# Altium project Cubesat Battery Board.PrjPcb
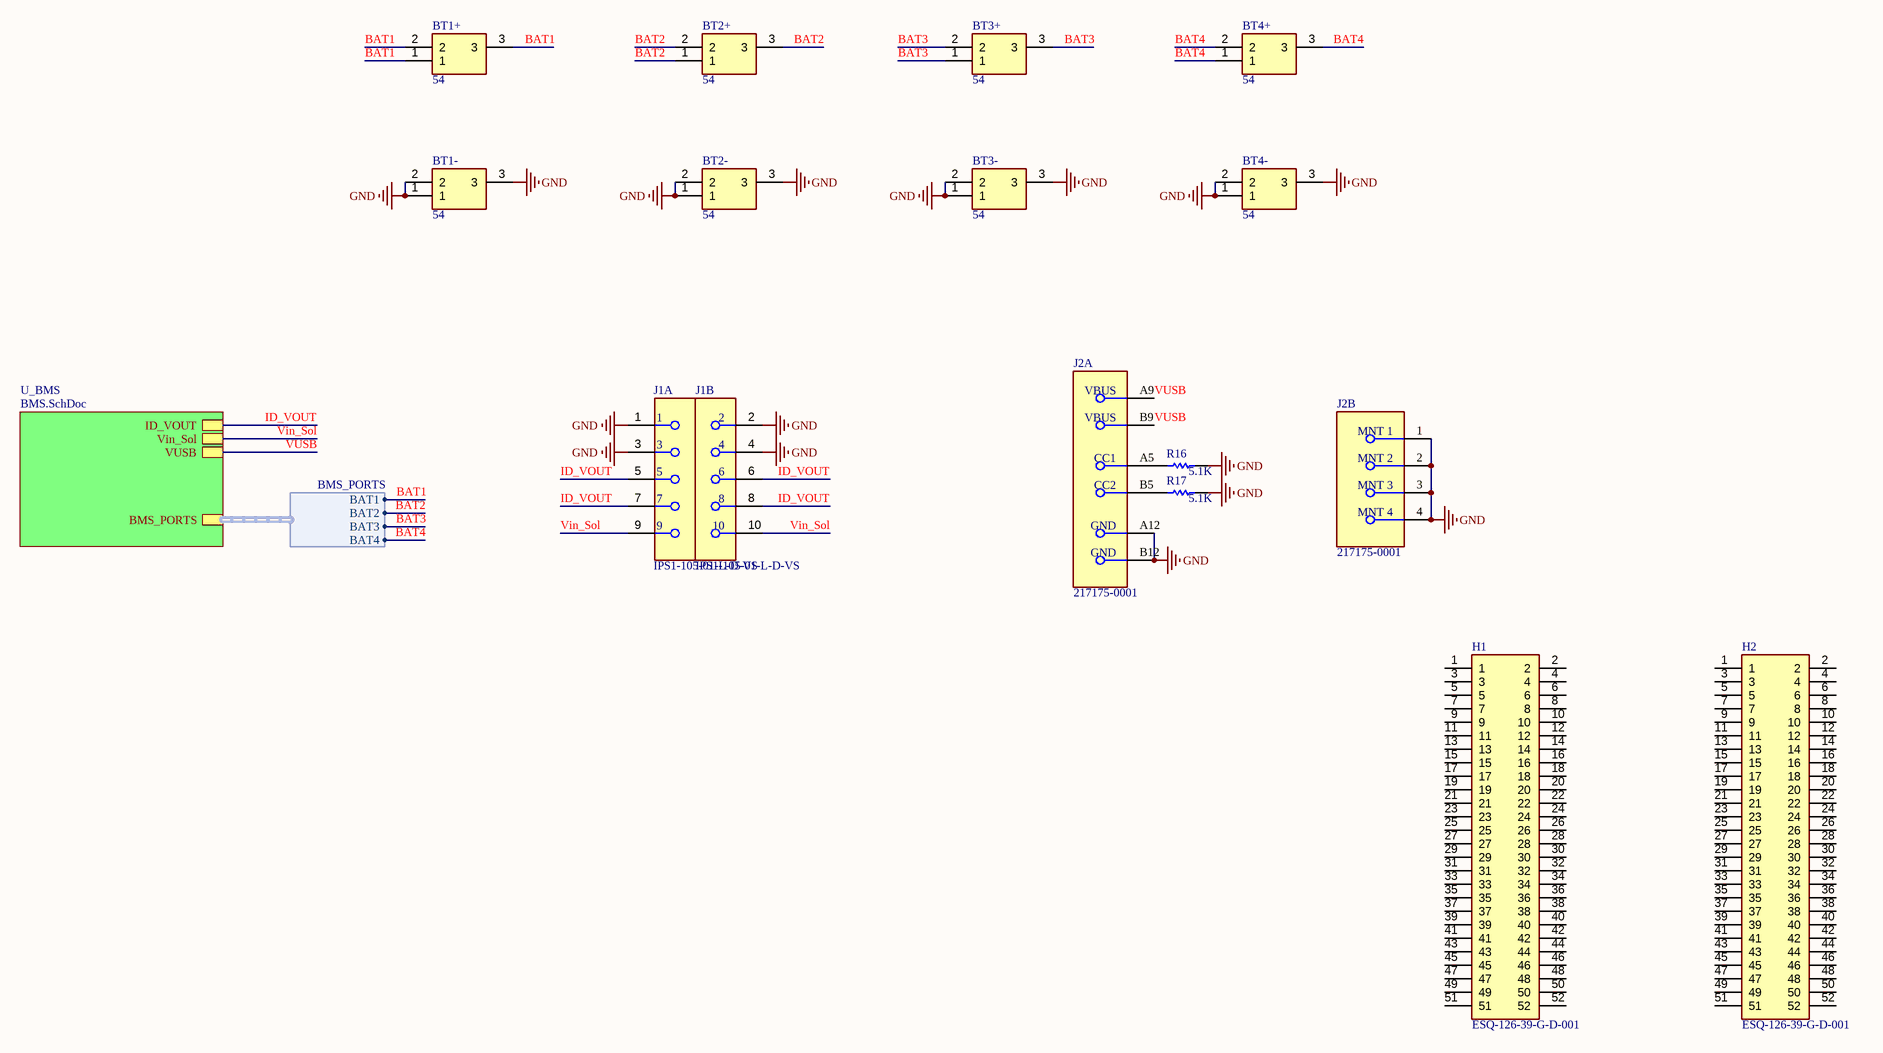
[diagram p0: Top.SchDoc]
CAGE_CODE: ?????; CONTRACT_NUMBER: <CONTRACT NO>; DOC_NO_ASSY_DWG: <ASSY DWG NO>; DOC_NO_BOM: <BOM DOC NO>; DOC_NO_FAB_DWG: <FAB DWG NO>; DOC_NO_SCH_DWG: <SCH DWG NO>; PCB_2_DEC_TOL: +/-.01; PCB_3_DEC_TOL: +/-.010; PCB_ANG_TOL: +/-1/2; PCB_ASSEMBLY_NO: <PCB ASSY NO>; PCB_CHECKER: - -----; PCB_CHECKER_APP_DATE: --/--/----; PCB_DESIGNER: - -----; PCB_DESIGNER_APP_DATE: --/--/----; PCB_DWG_NO: <PCB DWG NO>; PCB_ENGINEER: - -----; PCB_ENGINEER_APP_DATE: --/--/----; PCB_PART_NUMBER: <PCB PN>; PCB_REV: A; SCH_REV: A
3 sheets, 86 parts. Net scope: hierarchical (ports join the sheet entries above them; power ports are global).
Board files: battery board.PcbDoc, batteryreversed.PcbDoc
Sheets:
  Top.SchDoc
    U_BMS = BMS.SchDoc
      B1 = BatteryCharger.SchDoc
      B2 = BatteryCharger.SchDoc
      B3 = BatteryCharger.SchDoc
      B4 = BatteryCharger.SchDoc

## Sheet Top.SchDoc
size 420 x 297 mm; SheetNumber: 1; SheetTotal: 3

### Parts
BT1+  54  [54]
BT1-  54  [54]
BT2+  54  [54]
BT2-  54  [54]
BT3+  54  [54]
BT3-  54  [54]
BT4+  54  [54]
BT4-  54  [54]
H1  ESQ-126-39-G-D-001  [RHDR52W64P254_2X26_6654X495X1135P]
H2  ESQ-126-39-G-D-001  [RHDR52W64P254_2X26_6654X495X1135P]
J1  IPS1-105-01-L-D-VS  [FP-IPS1-105-01-L-D-VS-MFG]  (parts A,B of 2)
J2  217175-0001  [FP-217175-0001-MFG]  (parts A,B of 2)
R16  5.1K  [RESC1608X55X30LL15T15]
R17  5.1K  [RESC1608X55X30LL15T15]

### Sub-sheets
U_BMS = BMS.SchDoc: ID_VOUT, Vin_Sol, BMS_PORTS (harness BMS_PORTS), VUSB

### Harnesses
BMS_PORTS: BAT1, BAT2, BAT3, BAT4

### Nets
GND: BT1-.1 BT1-.2 BT1-.3 BT2-.1 BT2-.2 BT2-.3 BT3-.1 BT3-.2 BT3-.3 BT4-.1 BT4-.2 BT4-.3 J1.1 J1.2 J1.3 J1.4 J2.1(MNT_1) J2.2(MNT_2) J2.3(MNT_3) J2.4(MNT_4) J2.A12(GND) J2.B12(GND) R16.2 R17.2
BAT1: BT1+.1 BT1+.2 BT1+.3 ; sheet U_BMS/BMS_PORTS.BAT1
BAT2: BT2+.1 BT2+.2 BT2+.3 ; sheet U_BMS/BMS_PORTS.BAT2
BAT3: BT3+.1 BT3+.2 BT3+.3 ; sheet U_BMS/BMS_PORTS.BAT3
BAT4: BT4+.1 BT4+.2 BT4+.3 ; sheet U_BMS/BMS_PORTS.BAT4
ID_VOUT: J1.5 J1.6 J1.7 J1.8 ; sheet U_BMS/ID_VOUT
Vin_Sol: J1.9 J1.10 ; sheet U_BMS/Vin_Sol
VUSB: J2.A9(VBUS) J2.B9(VBUS) ; sheet U_BMS/VUSB
NetJ2_A5: J2.A5(CC1) R16.1
NetJ2_B5: J2.B5(CC2) R17.1

Not connected (* = marked no-connect by the designer): H1 1 2 3 4 5 6 7 8 9 10 11 12 13 14 15 16 17 18 19 20 21 22 23 24 25 26 27 28 29 30 31 32 33 34 35 36 37 38 39 40 41 42 43 44 45 46 47 48 49 50 51 52; H2 1 2 3 4 5 6 7 8 9 10 11 12 13 14 15 16 17 18 19 20 21 22 23 24 25 26 27 28 29 30 31 32 33 34 35 36 37 38 39 40 41 42 43 44 45 46 47 48 49 50 51 52

### Notes on the sheet
- THIS DOCUMENT AND THE DATA DISCLOSED HEREIN OR
- HEREWITH IS THE PROPERTY OF ALTIUM LIMITED AND MAY
- DWG NO:
- REVISION
- REV:
- DESCRIPTION
- DATE
- APPROVED
- BE FREELY DISTRIBUTED IN WHOLE. NO RIGHTS ARE
- RESERVED OR EXPRESS OR IMPLIED WARANTEE GIVEN.
- ENG:
- APPROVALS
- PROJECT
- DSN:
- CHK:
- REFERENCE DOCUMENTS
- PROJECT REVISION:
- TITLE
- DOCUMENT REVISION:
- DESIGN ITEM:
- BOM:
- FAB DWG:
- PCB DWG:
- ASSY DWG:
- SCALE:
- A3
- SIZE
- CAGE CODE
- FILE NAME
- DWG NO.
- SHEET
- OF
- REV

### Library data of the parts
BT1+ BT1- BT2+ BT2- BT3+ BT3- BT4+ BT4- = CMP-00029-00001-1: Battery; Manufacturer_Name: Keystone Electronics; Mouser Part Number: 534-54; Height: 16.97mm; Manufacturer_Part_Number: 54; Source: SamacSys.SchLib; Arrow Price/Stock: https://www.arrow.com/en/products/54/keystone-electronics?utm_currency=USD&region=europe; Datasheet Link: http://www.keyelco.com/product-pdf.cfm?p=826; Design Item ID: 54; Mouser Price/Stock: https://www.mouser.co.uk/ProductDetail/Keystone-Electronics/54?qs=73q%2FgRcW4F3NakoJDesViw%3D%3D; Arrow Part Number: 54
H1 H2 = CMP-002-00086-1: PC / 104 Connectors Elevated Socket Strip; Manufacturer_Name: SAMTEC; Design Item ID: ESQ-126-39-G-D-001; Mouser Price/Stock: https://www.mouser.co.uk/ProductDetail/Samtec/ESQ-126-39-G-D-001?qs=PB6%2FjmICvI2K%2FCIgL4SVbg%3D%3D; Mouser Part Number: 200-ESQ12639GD001; Source: SamacSys.SchLib; Arrow Price/Stock: https://www.arrow.com/en/products/esq-126-39-g-d-001/samtec?region=nac; Arrow Part Number: ESQ-126-39-G-D-001; Manufacturer_Part_Number: ESQ-126-39-G-D-001; Datasheet Link: http://suddendocs.samtec.com/catalog_english/esq_th.pdf; Height: 11.35mm
J1 = CMP-02766-000002-1: CONN RCPT 10POS 0.1 GOLD SMD; Manufacturer: Samtec; Standoff Height: 1.02mm; Is Female: yes; Voltage Rating: 1095V; Conn Orientation: Vertical; Conn Gender: Female; Pitch: 2.54mm; Number Of Contacts: 10; Package: 0; Category: Conn; Automotive: No; Height: 8.64mm; Temperature Range High: +125°C; Device Class L3: unset; Number Of Rows: 2; Device Class L2: Headers and Wire Housings; Device Class L1: Connectors; RoHS: TRUE; Temperature Range Low: -55°C; Octopart: https://octopart.com/ips1-105-01-l-d-vs-samtec-19544880; Temperature: -55°C to +125°C; Contact Material: Gold,Nickel; Digikey Description: CONN RCPT 10POS 0.1 GOLD SMD; Manufacturer Part Number: IPS1-105-01-L-D-VS; ComponentLink2URL: http://suddendocs.samtec.com/prints/ips1-1xx-xx-xx-d-vs-xx-xx-mkt.pdf; Footprint Url: http://suddendocs.samtec.com/prints/ips1-vs.pdf; ComponentLink2Description: Datasheet; Lead Free: Yes
J2 = CMP-04767-000026-1: CONN RCP USB2.0 C 6+18P SMD RA
R16 R17 = CMP-2000-00803-1: Part Number: ERJ-3GEYJ512V; Manufacturer: Panasonic

## Sheet BMS.SchDoc
size 420 x 297 mm; SheetNumber: 2; SheetTotal: 3
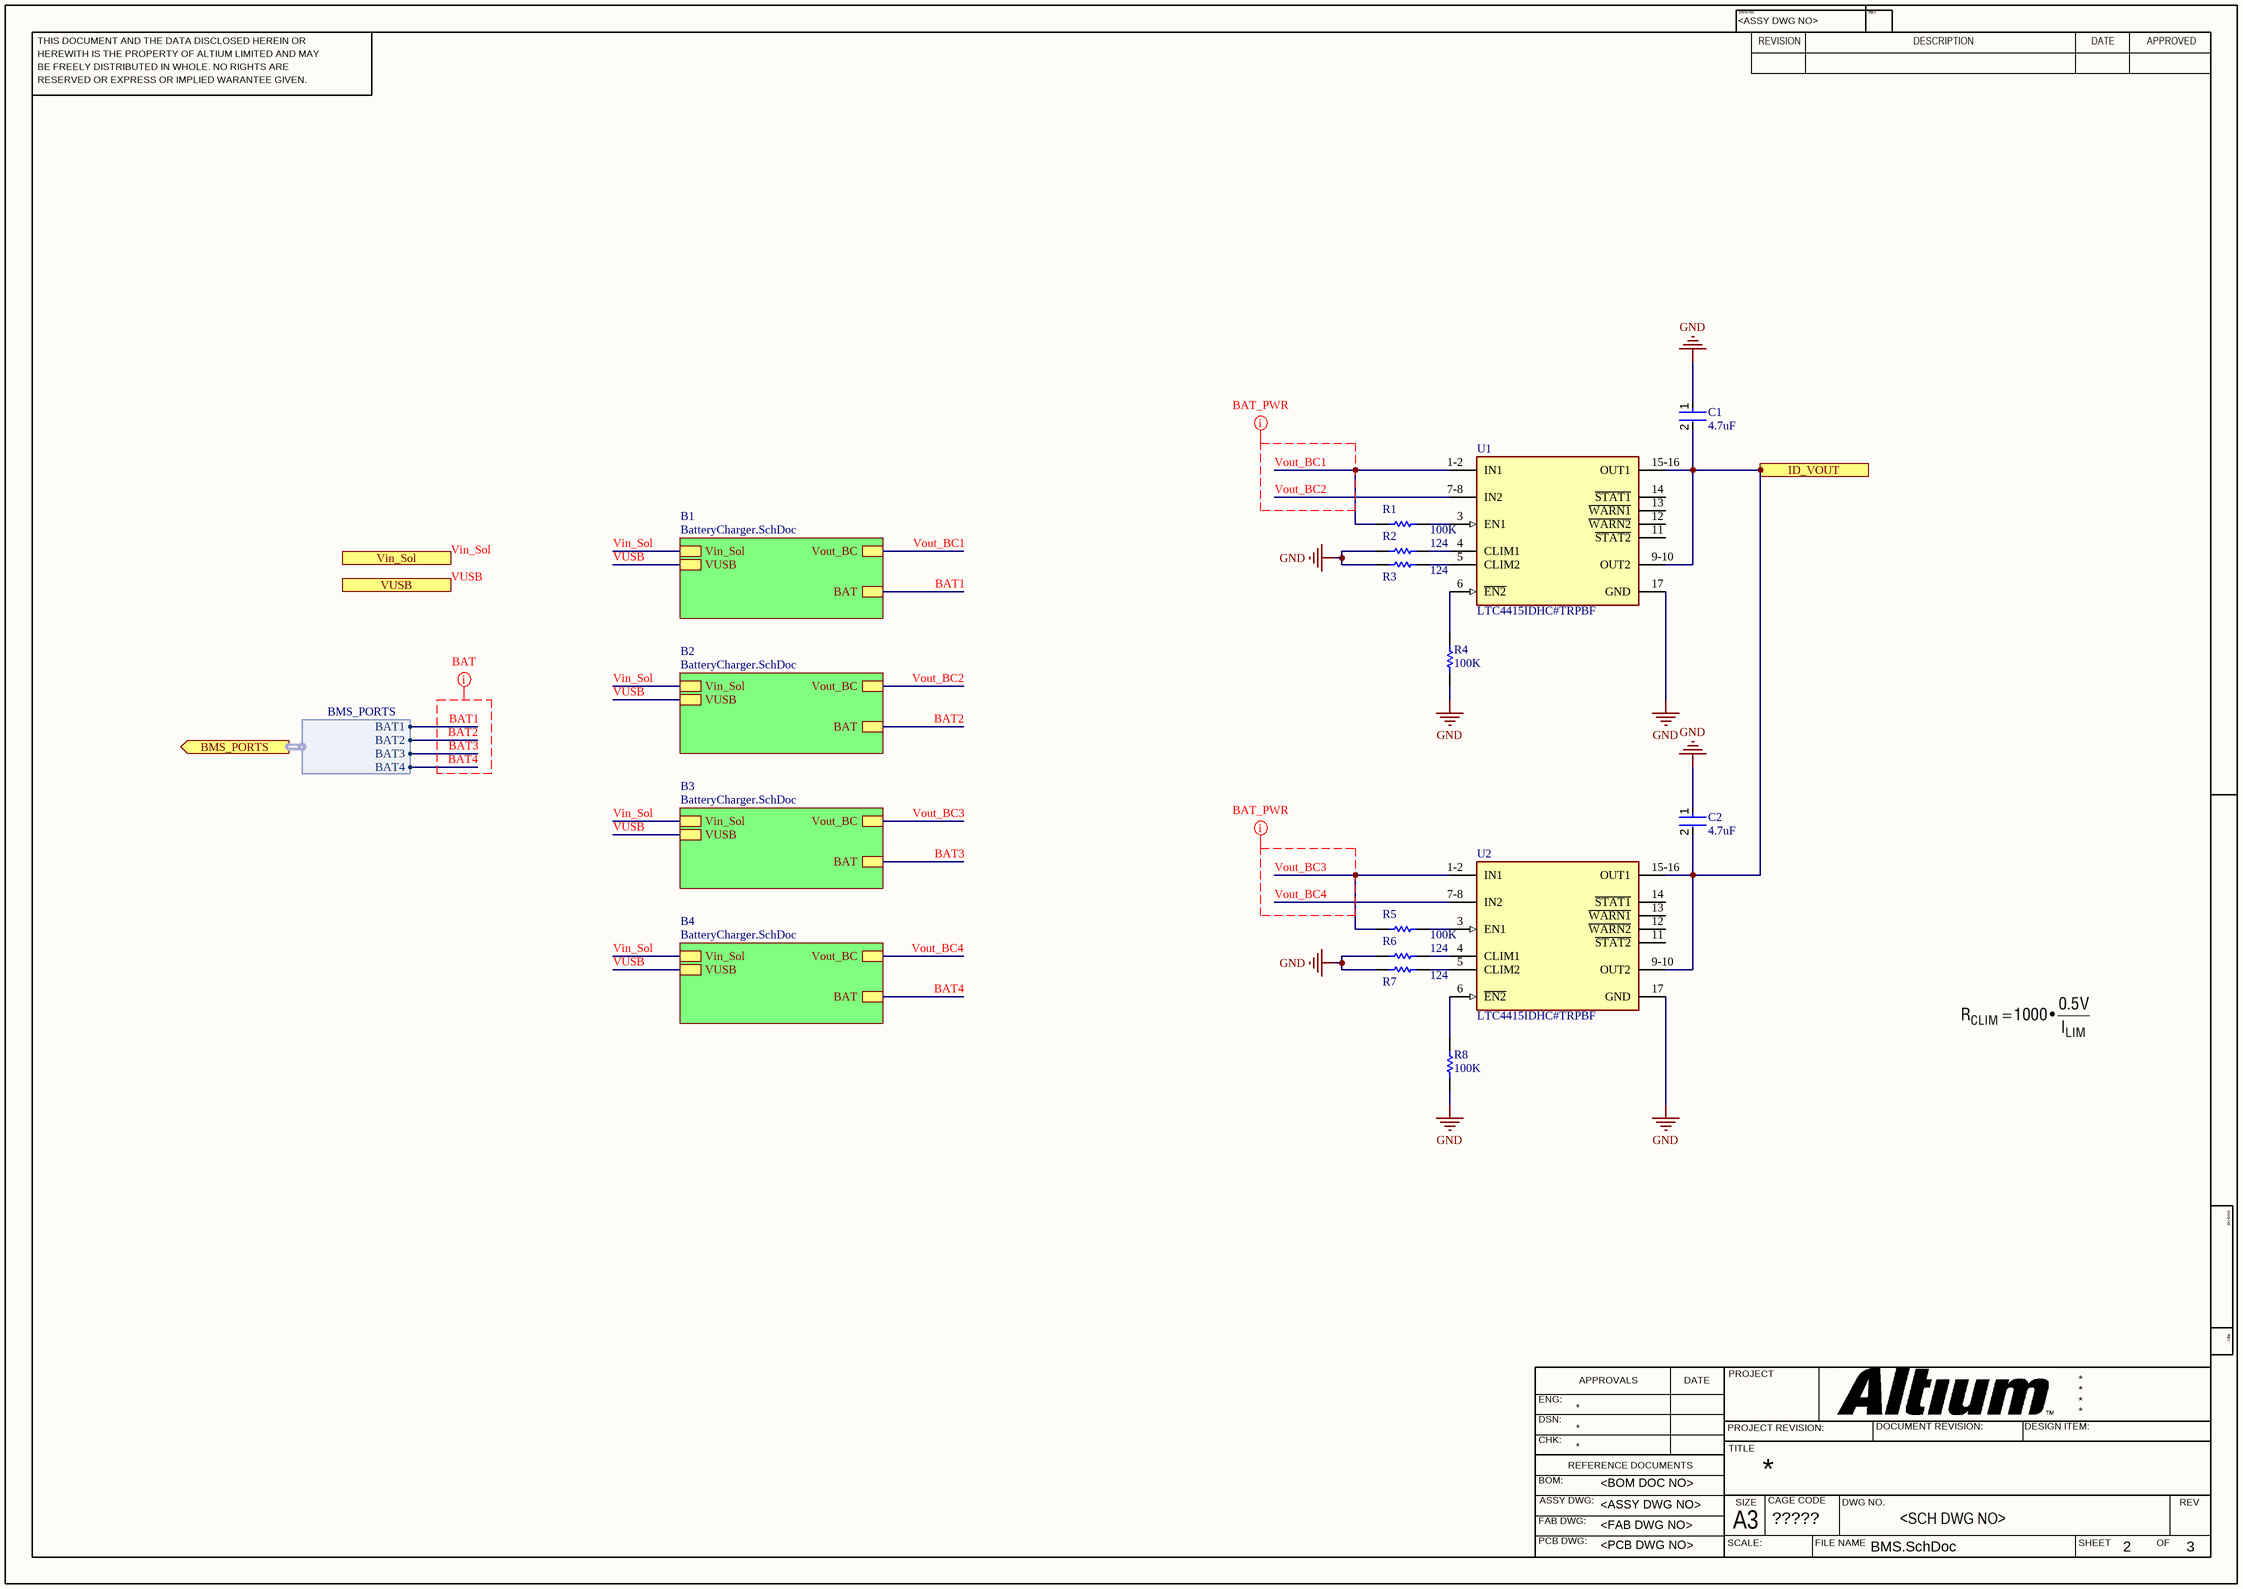
[diagram p1: BMS.SchDoc]

### Parts
C1  4.7uF  [FP-GRM188-0_15-IPC_A]
C2  4.7uF  [FP-GRM188-0_15-IPC_A]
R1  100K  [RESC1608X55X30ML20T10]
R2  124  [RESC1608X55X30NL20T20]
R3  124  [RESC1608X55X30NL20T20]
R4  100K  [RESC1608X55X30ML20T10]
R5  100K  [RESC1608X55X30ML20T10]
R6  124  [RESC1608X55X30NL20T20]
R7  124  [RESC1608X55X30NL20T20]
R8  100K  [RESC1608X55X30ML20T10]
U1  LTC4415IDHC#TRPBF  [FP-DHC-16-05-08-1872-MFG]
U2  LTC4415IDHC#TRPBF  [FP-DHC-16-05-08-1872-MFG]

### Sub-sheets
B1 = BatteryCharger.SchDoc: Vin_Sol, BAT, VUSB, Vout_BC
B2 = BatteryCharger.SchDoc: Vin_Sol, BAT, VUSB, Vout_BC
B3 = BatteryCharger.SchDoc: Vin_Sol, BAT, VUSB, Vout_BC
B4 = BatteryCharger.SchDoc: Vin_Sol, BAT, VUSB, Vout_BC

### Ports
BMS_PORTS (out, harness BMS_PORTS), ID_VOUT, Vin_Sol, VUSB

### Harnesses
BMS_PORTS: BAT1, BAT2, BAT3, BAT4

### Nets
GND: C1.1 C2.1 R2.1 R3.1 R4.2 R6.1 R7.1 R8.2 U1.17(GND) U2.17(GND)
BAT1: sheet B1/BAT, port BMS_PORTS.BAT1
BAT2: sheet B2/BAT, port BMS_PORTS.BAT2
BAT3: sheet B3/BAT, port BMS_PORTS.BAT3
BAT4: sheet B4/BAT, port BMS_PORTS.BAT4
ID_VOUT: C1.2 C2.2 U1.9-10(OUT2) U1.15-16(OUT1) U2.9-10(OUT2) U2.15-16(OUT1) ; port ID_VOUT
Vin_Sol: port Vin_Sol, sheet B1/Vin_Sol, sheet B2/Vin_Sol, sheet B3/Vin_Sol, sheet B4/Vin_Sol
Vout_BC1: R1.2 U1.1-2(IN1) ; sheet B1/Vout_BC
Vout_BC2: U1.7-8(IN2) ; sheet B2/Vout_BC
Vout_BC3: R5.2 U2.1-2(IN1) ; sheet B3/Vout_BC
Vout_BC4: U2.7-8(IN2) ; sheet B4/Vout_BC
VUSB: port VUSB, sheet B1/VUSB, sheet B2/VUSB, sheet B3/VUSB, sheet B4/VUSB
NetR1_1: R1.1 U1.3(EN1)
NetR2_2: R2.2 U1.4(CLIM1)
NetR3_2: R3.2 U1.5(CLIM2)
NetR4_1: R4.1 U1.6(~{EN2})
NetR5_1: R5.1 U2.3(EN1)
NetR6_2: R6.2 U2.4(CLIM1)
NetR7_2: R7.2 U2.5(CLIM2)
NetR8_1: R8.1 U2.6(~{EN2})

Not connected (* = marked no-connect by the designer): U1 11(~{STAT2}) 12(~{WARN2}) 13(~{WARN1}) 14(~{STAT1}); U2 11(~{STAT2}) 12(~{WARN2}) 13(~{WARN1}) 14(~{STAT1})

### Layout directives
net class BAT: BAT1, BAT2, BAT3, BAT4
net class BAT_PWR: Vout_BC1, Vout_BC2, Vout_BC3, Vout_BC4

### Notes on the sheet
- THIS DOCUMENT AND THE DATA DISCLOSED HEREIN OR
- HEREWITH IS THE PROPERTY OF ALTIUM LIMITED AND MAY
- DWG NO:
- REVISION
- REV:
- DESCRIPTION
- DATE
- APPROVED
- BE FREELY DISTRIBUTED IN WHOLE. NO RIGHTS ARE
- RESERVED OR EXPRESS OR IMPLIED WARANTEE GIVEN.
- ENG:
- APPROVALS
- PROJECT
- DSN:
- CHK:
- REFERENCE DOCUMENTS
- PROJECT REVISION:
- TITLE
- DOCUMENT REVISION:
- DESIGN ITEM:
- BOM:
- FAB DWG:
- PCB DWG:
- ASSY DWG:
- SCALE:
- A3
- SIZE
- CAGE CODE
- FILE NAME
- DWG NO.
- SHEET
- OF
- REV

### Library data of the parts
C1 C2 = CMP-06035-000034-2: CAP CER 4.7UF 10V X7S 0603; Material: Ceramic; Tolerance: 10%; Height: 0.8mm; Termination: SMD/SMT; Case Code (Metric): 1608; Voltage Rating: 10V; Width: 0.8mm; Resistor Type: Ceramic; Length: 1.6mm; Voltage Rating (DC): 10V; Weight: 0.000222oz; Dielectric: X7S; Package Quantity: 4000; Mount: Surface Mount; Case Code (Imperial): 0603; Case/Package: 0603; Packaging: Tape and Reel; Thickness: 0.037inch; Min Operating Temperature: -55°C; Capacitance: 4.7uF; Max Operating Temperature: 125°C
R1 R4 R5 R8 = CMP-2000-01852-1: Part Number: RK73B1JTTD104J; Manufacturer: KOA Speer
R2 R3 R6 R7 = CMP-2000-00899-1: Part Number: ERA3AEB1240V; Manufacturer: Panasonic
U1 U2 = CMP-0479-00071-2: IC OR CTRLR SRC SELECT 16DFN; Operating Supply Current: 44uA; Max Output Current: 4A; Case/Package: DFN; Series: PowerPath™; Packaging: Tape and Reel; Lead Free: Lead Free; RoHS Compliant: Yes; Package Quantity: 2500; Max Operating Temperature: 125°C; Min Operating Temperature: -40°C; Number of Pins: 16; Length: 5mm

## Sheet BatteryCharger.SchDoc
size 420 x 297 mm; SheetNumber: 3; SheetTotal: 3
Used 4 times, as channels U_BMS/B1, U_BMS/B2, U_BMS/B3, U_BMS/B4. Parts and nets are listed once, with the designators drawn on the sheet.
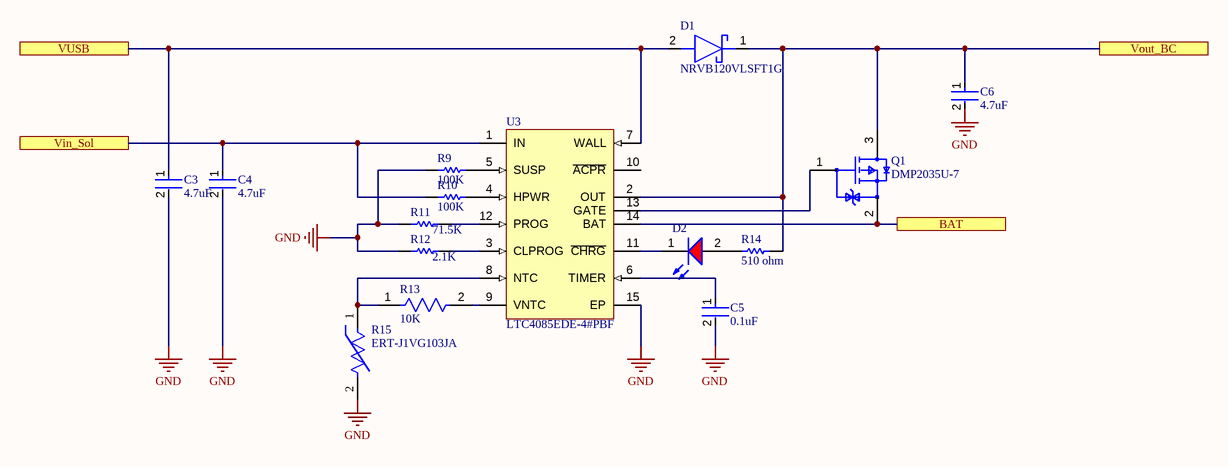
[diagram p2: BatteryCharger.SchDoc]

### Parts
C3  4.7uF  [FP-GRM188-0_15-IPC_A]
C4  4.7uF  [FP-GRM188-0_15-IPC_A]
C5  0.1uF  [FP-C0603C-CF-MFG]
C6  4.7uF  [FP-GRM188-0_15-IPC_A]
D1  NRVB120VLSFT1G  [SODFL3616X98N]
D2  (no value)  [WL-SMCW_0603_150060xx75000]
Q1  DMP2035U-7  [FP-SOT23-IPC_A]
R9  100K  [RESC1608X55X30ML20T10]
R10  100K  [RESC1608X55X30ML20T10]
R11  71.5K  [RESC1608X55X30NL15T15]
R12  2.1K  [RESC1608X55X30NL15T15]
R13  10K  [FP-RK73B1J-MFG]
R14  510 ohm  [RESC1608X55X30ML15T15]
R15  ERT-J1VG103JA  [FP-ERTJ1-IPC_C]
U3  LTC4085EDE-4#PBF  [LT-DE-14_V]

### Ports
BAT, Vin_Sol, Vout_BC, VUSB

### Nets
GND: C3.2 C4.2 C5.2 C6.2 R9.2 R11.1 R12.1 R15.2 U3.15(EP)
BAT: Q1.2(S) U3.14(BAT) ; port BAT
Vin_Sol: C4.1 R10.2 U3.1(IN) ; port Vin_Sol
Vout_BC: C6.1 D1.1(K) Q1.3(D) R14.2 U3.2(OUT) ; port Vout_BC
VUSB: C3.1 D1.2(A) U3.7(WALL) ; port VUSB
NetC5_1: C5.1 U3.6(TIMER)
NetD2_1: D2.1(K) U3.11(~{CHRG})
NetD2_2: D2.2(A) R14.1
NetQ1_1: Q1.1(G) U3.13(GATE)
NetR9_1: R9.1 U3.5(SUSP)
NetR10_1: R10.1 U3.4(HPWR)
NetR11_2: R11.2 U3.12(PROG)
NetR12_2: R12.2 U3.3(CLPROG)
NetR13_1: R13.1 R15.1 U3.8(NTC)
NetR13_2: R13.2 U3.9(VNTC)

Not connected (* = marked no-connect by the designer): U3 10(~{ACPR})

### Channels
U_BMS/B1: designators end in _B1; ports BAT=BAT1 Vin_Sol=Vin_Sol Vout_BC=Vout_BC1 VUSB=VUSB
U_BMS/B2: designators end in _B2; ports BAT=BAT2 Vin_Sol=Vin_Sol Vout_BC=Vout_BC2 VUSB=VUSB
U_BMS/B3: designators end in _B3; ports BAT=BAT3 Vin_Sol=Vin_Sol Vout_BC=Vout_BC3 VUSB=VUSB
U_BMS/B4: designators end in _B4; ports BAT=BAT4 Vin_Sol=Vin_Sol Vout_BC=Vout_BC4 VUSB=VUSB

### Notes on the sheet
- THIS DOCUMENT AND THE DATA DISCLOSED HEREIN OR
- HEREWITH IS THE PROPERTY OF ALTIUM LIMITED AND MAY
- DWG NO:
- REVISION
- REV:
- DESCRIPTION
- DATE
- APPROVED
- BE FREELY DISTRIBUTED IN WHOLE. NO RIGHTS ARE
- RESERVED OR EXPRESS OR IMPLIED WARANTEE GIVEN.
- ENG:
- APPROVALS
- PROJECT
- DSN:
- CHK:
- REFERENCE DOCUMENTS
- PROJECT REVISION:
- TITLE
- DOCUMENT REVISION:
- DESIGN ITEM:
- BOM:
- FAB DWG:
- PCB DWG:
- ASSY DWG:
- SCALE:
- A3
- SIZE
- CAGE CODE
- FILE NAME
- DWG NO.
- SHEET
- OF
- REV

### Library data of the parts
C3 C4 C6 = CMP-06035-000034-2: as C1 on sheet BMS; Height: 0.8mm; Termination: SMD/SMT; Case Code (Metric): 1608; Voltage Rating: 10V; Width: 0.8mm; Resistor Type: Ceramic; Length: 1.6mm; Voltage Rating (DC): 10V; Weight: 0.000222oz; Dielectric: X7S; Package Quantity: 4000; Mount: Surface Mount; Case Code (Imperial): 0603; Case/Package: 0603; Packaging: Tape and Reel; Thickness: 0.037inch; Min Operating Temperature: -55°C; Capacitance: 4.7uF; Max Operating Temperature: 125°C
C5 = CMP-2006-03061-2: CAP CER 0.1UF 50V X7R 0603; Manufacturer: KEMET; Manufacturer Part Number: C0603C104K5RACTU; Tolerance: 0.1; Temperature Coefficient: 30ppm/°C; Material: Ceramic; Automotive Grade: Grade 1; Value: 0.10 μF; Temperature: -55°C to +125°C; RoHS: TRUE; Temperature Range High: +125°C; Lead Free: Yes; Octopart: https://octopart.com/c0603c104k5ractu-kemet-139244; Digikey Description: CAP CER 0.1UF 50V X7R 0603; Category: Cap; Package: C0603C-CF; ComponentLink2Description: Datasheet; Temperature Range Low: -55°C; Device Class L1: Passive Components; Voltage Rating: 50 V; Automotive: Yes; Device Class L3: Ceramic Capacitors; ComponentLink2URL: https://api.kemet.com/component-edge/download/datasheet/C0603C100J5GACAUTO.pdf; Capacitance: 0.10 μF; Device Class L2: Capacitors; Temperature Characteristic: X7R; Height: 0.87mm
D1 = NRVB120VLSFT1G: Schottky Diode; Manufacturer_Name: onsemi; Datasheet Link: https://www.onsemi.com/pub/Collateral/MBR120VLSFT1-D.PDF; Height: 0.98mm; Manufacturer_Part_Number: NRVB120VLSFT1G; Mouser Part Number: 863-NRVB120VLSFT1G; Mouser Price/Stock: https://www.mouser.co.uk/ProductDetail/onsemi/NRVB120VLSFT1G?qs=tCMd4XlZ%2FiDc2vkUzw3hig%3D%3D; Arrow Part Number: NRVB120VLSFT1G; Arrow Price/Stock: null?utm_currency=USD&region=nac
D2 = CMP-1426-00001-4: LED Low-Power Uni-Color Red 630nm 2V 2-Pin Chip 0603(1608Metric) T/R; Max Junction Temperature (Tj): 95°C; Dominant Wavelength: 625nm; Lens Style: Clear, Rectangular; Viewing Angle: 140°; Forward Current: 100mA; Max Reverse Voltage (DC): 5V; Luminous Intensity: 250mcd; Test Current: 20mA; Power Dissipation: 72mW; Max Operating Temperature: 85°C; Mount: Surface Mount; Height: 700µm; Packaging: Tape and Reel; REACH SVHC: Unknown; Case Code (Metric): 1608; Peak Wavelength: 630nm; Forward Voltage: 2V; Case/Package: 0603; Color: Red; RoHS: Compliant; Width: 800µm; Reverse Voltage: 5V; Min Operating Temperature: -40°C; Wavelength: 625nm; Case Code (Imperial): 0603; Length: 1.6mm
Q1 = CMP-2000-06174-3: MOSFET P-CH 20V 3.6A SOT-23; Gate to Source Voltage (Vgs): 8V; Input Capacitance: 1.61nF; Rise Time: 12.4ns; On-State Resistance: 62mR; Turn-On Delay Time: 16.8ns; Element Configuration: Single; Turn-Off Delay Time: 94.1ns; Drain to Source Resistance: 23mR; Number of Channels: 1; Fall Time: 42.4ns; Rds On Max: 35mR; Drain to Source Breakdown Voltage: -20V; Power Dissipation: 810mW; Package Quantity: 3000; Max Operating Temperature: 150°C; REACH SVHC: No SVHC; Min Operating Temperature: -55°C; Contact Plating: Tin; Height: 1.1mm; Width: 1.4mm; Mount: Surface Mount; Length: 3mm; Lead Free: Lead Free; Number of Pins: 3; Continuous Drain Current (ID): 3.6A; Drain to Source Voltage (Vdss): 20V; Weight: 0.000282oz; Radiation Hardening: No; Number of Elements: 1; Case/Package: SOT-23-3; Max Power Dissipation: 810mW; Packaging: Tape and Reel
R9 R10 = CMP-2000-01852-1: as R1 on sheet BMS
R11 = CMP-2000-00629-1: Part Number: ERJ-3EKF7152V; Manufacturer: Panasonic
R12 = CMP-2000-00327-1: Part Number: ERJ-3EKF2101V; Manufacturer: Panasonic
R13 = CMP-2000-01851-2: RES 10K OHM 5% 1/10W 0603; Temperature Coefficient: 200ppm/°C; Voltage Rating: 50V; Power Rating: 100mW; Resistance: 10kR; Length: 1.6mm; Lead Free: Lead Free; Resistance Tolerance: 5%; Case Code (Metric): 1608; Width: 0.8mm; Height: 0.45mm; Max Operating Temperature: 155°C; RoHS Compliant: Yes; Resistor Type: Thick Film; Min Operating Temperature: -55°C; Case Code (Imperial): 0603; Technology: THICK FILM; Package Quantity: 5000; Tolerance: 5%; Case/Package: 0603; Voltage Rating (DC): 50V; Depth: 0.8mm; Packaging: Tape and Reel; Number of Pins: 2; Construction: Rectangular; Series: RK73B; Military Standard: Not; Termination: SMD/SMT
R14 = CMP-2000-00802-1: Manufacturer: Panasonic; Part Number: ERJ-3GEYJ511V
R15 = CMP-05419-000002-1: THERMISTOR NTC 10KOHM 3380K 0603; Tolerance: 5%; Resistance: 10kR; Max Power Dissipation: 100mW; Accuracy: 1%; Case Code (Metric): 1608; Lead Free: Lead Free; Max Operating Temperature: 125°C; Termination: SMD/SMT; Radiation Hardening: No; Series: ERT-J; Length: 1.6mm; Depth: 0.8mm; RoHS Compliant: Yes; Number of Pins: 2; Case/Package: 0603; Packaging: Tape and Reel; Width: 800um; REACH SVHC: No SVHC; Min Operating Temperature: -40°C; Package Quantity: 4000; Case Code (Imperial): 0603; Resistance Tolerance: 5%; Mount: Surface Mount
U3 = CMP-0478-00063-1: USB Power Manager with Ideal Diode Controller and 3.95 V Li-Ion Charger, 32.6% Vvntc, No Undervoltage Current Limit, 4.35 to 5.5 V Vin, 14-pin SON (DE-14), -40 to 85 degC, Pb-Free; Manufacturer: Linear Technology; Vin Min(V): 4.35; Number of Outputs: 1; Vin Max(V): 5.5; PackageReference: DE-14; DatasheetVersion: Rev. B; ComponentLink1Description: Manufacturer URL; PackageVersion: Rev. B, 06/2010; Number of Cells: 1; ComponentLink3Description: Package Specification; ComponentLink1URL: http://www.linear.com/; ComponentLink3URL: http://www.linear.com/docs/en/packaging/DFN_14_05-08-1708.pdf; ComponentLink2URL: http://cds.linear.com/docs/en/datasheet/408534fb.pdf; PartNumber: LTC4085EDE-4#PBF; Code_JEDEC: MO-229; ComponentLink2Description: Datasheet; RoHS: TRUE; PackageDescription: 14-Pin Plastic DFN, Body 4 x 3 mm, Pitch 0.5 mm; Mounting Technology: Surface Mount

## Nets that join several sheets
GND: Top (24 pins), BMS (10 pins), U_BMS/B1 (9 pins), U_BMS/B2 (9 pins), U_BMS/B3 (9 pins), U_BMS/B4 (9 pins)
BAT1: Top (BT1+.1 BT1+.2 BT1+.3), U_BMS/B1 (Q1_B1.2 U3_B1.14)
BAT2: Top (BT2+.1 BT2+.2 BT2+.3), U_BMS/B2 (Q1_B2.2 U3_B2.14)
BAT3: Top (BT3+.1 BT3+.2 BT3+.3), U_BMS/B3 (Q1_B3.2 U3_B3.14)
BAT4: Top (BT4+.1 BT4+.2 BT4+.3), U_BMS/B4 (Q1_B4.2 U3_B4.14)
ID_VOUT: Top (J1.5 J1.6 J1.7 J1.8), BMS (6 pins)
Vin_Sol: Top (J1.9 J1.10), U_BMS/B1 (C4_B1.1 R10_B1.2 U3_B1.1), U_BMS/B2 (C4_B2.1 R10_B2.2 U3_B2.1), U_BMS/B3 (C4_B3.1 R10_B3.2 U3_B3.1), U_BMS/B4 (C4_B4.1 R10_B4.2 U3_B4.1)
Vout_BC1: BMS (R1.2 U1.1-2), U_BMS/B1 (5 pins)
Vout_BC2: BMS (U1.7-8), U_BMS/B2 (5 pins)
Vout_BC3: BMS (R5.2 U2.1-2), U_BMS/B3 (5 pins)
Vout_BC4: BMS (U2.7-8), U_BMS/B4 (5 pins)
VUSB: Top (J2.A9 J2.B9), U_BMS/B1 (C3_B1.1 D1_B1.2 U3_B1.7), U_BMS/B2 (C3_B2.1 D1_B2.2 U3_B2.7), U_BMS/B3 (C3_B3.1 D1_B3.2 U3_B3.7), U_BMS/B4 (C3_B4.1 D1_B4.2 U3_B4.7)